# Altium project PMP20873E1.PrjPcb (part 4 of 4)
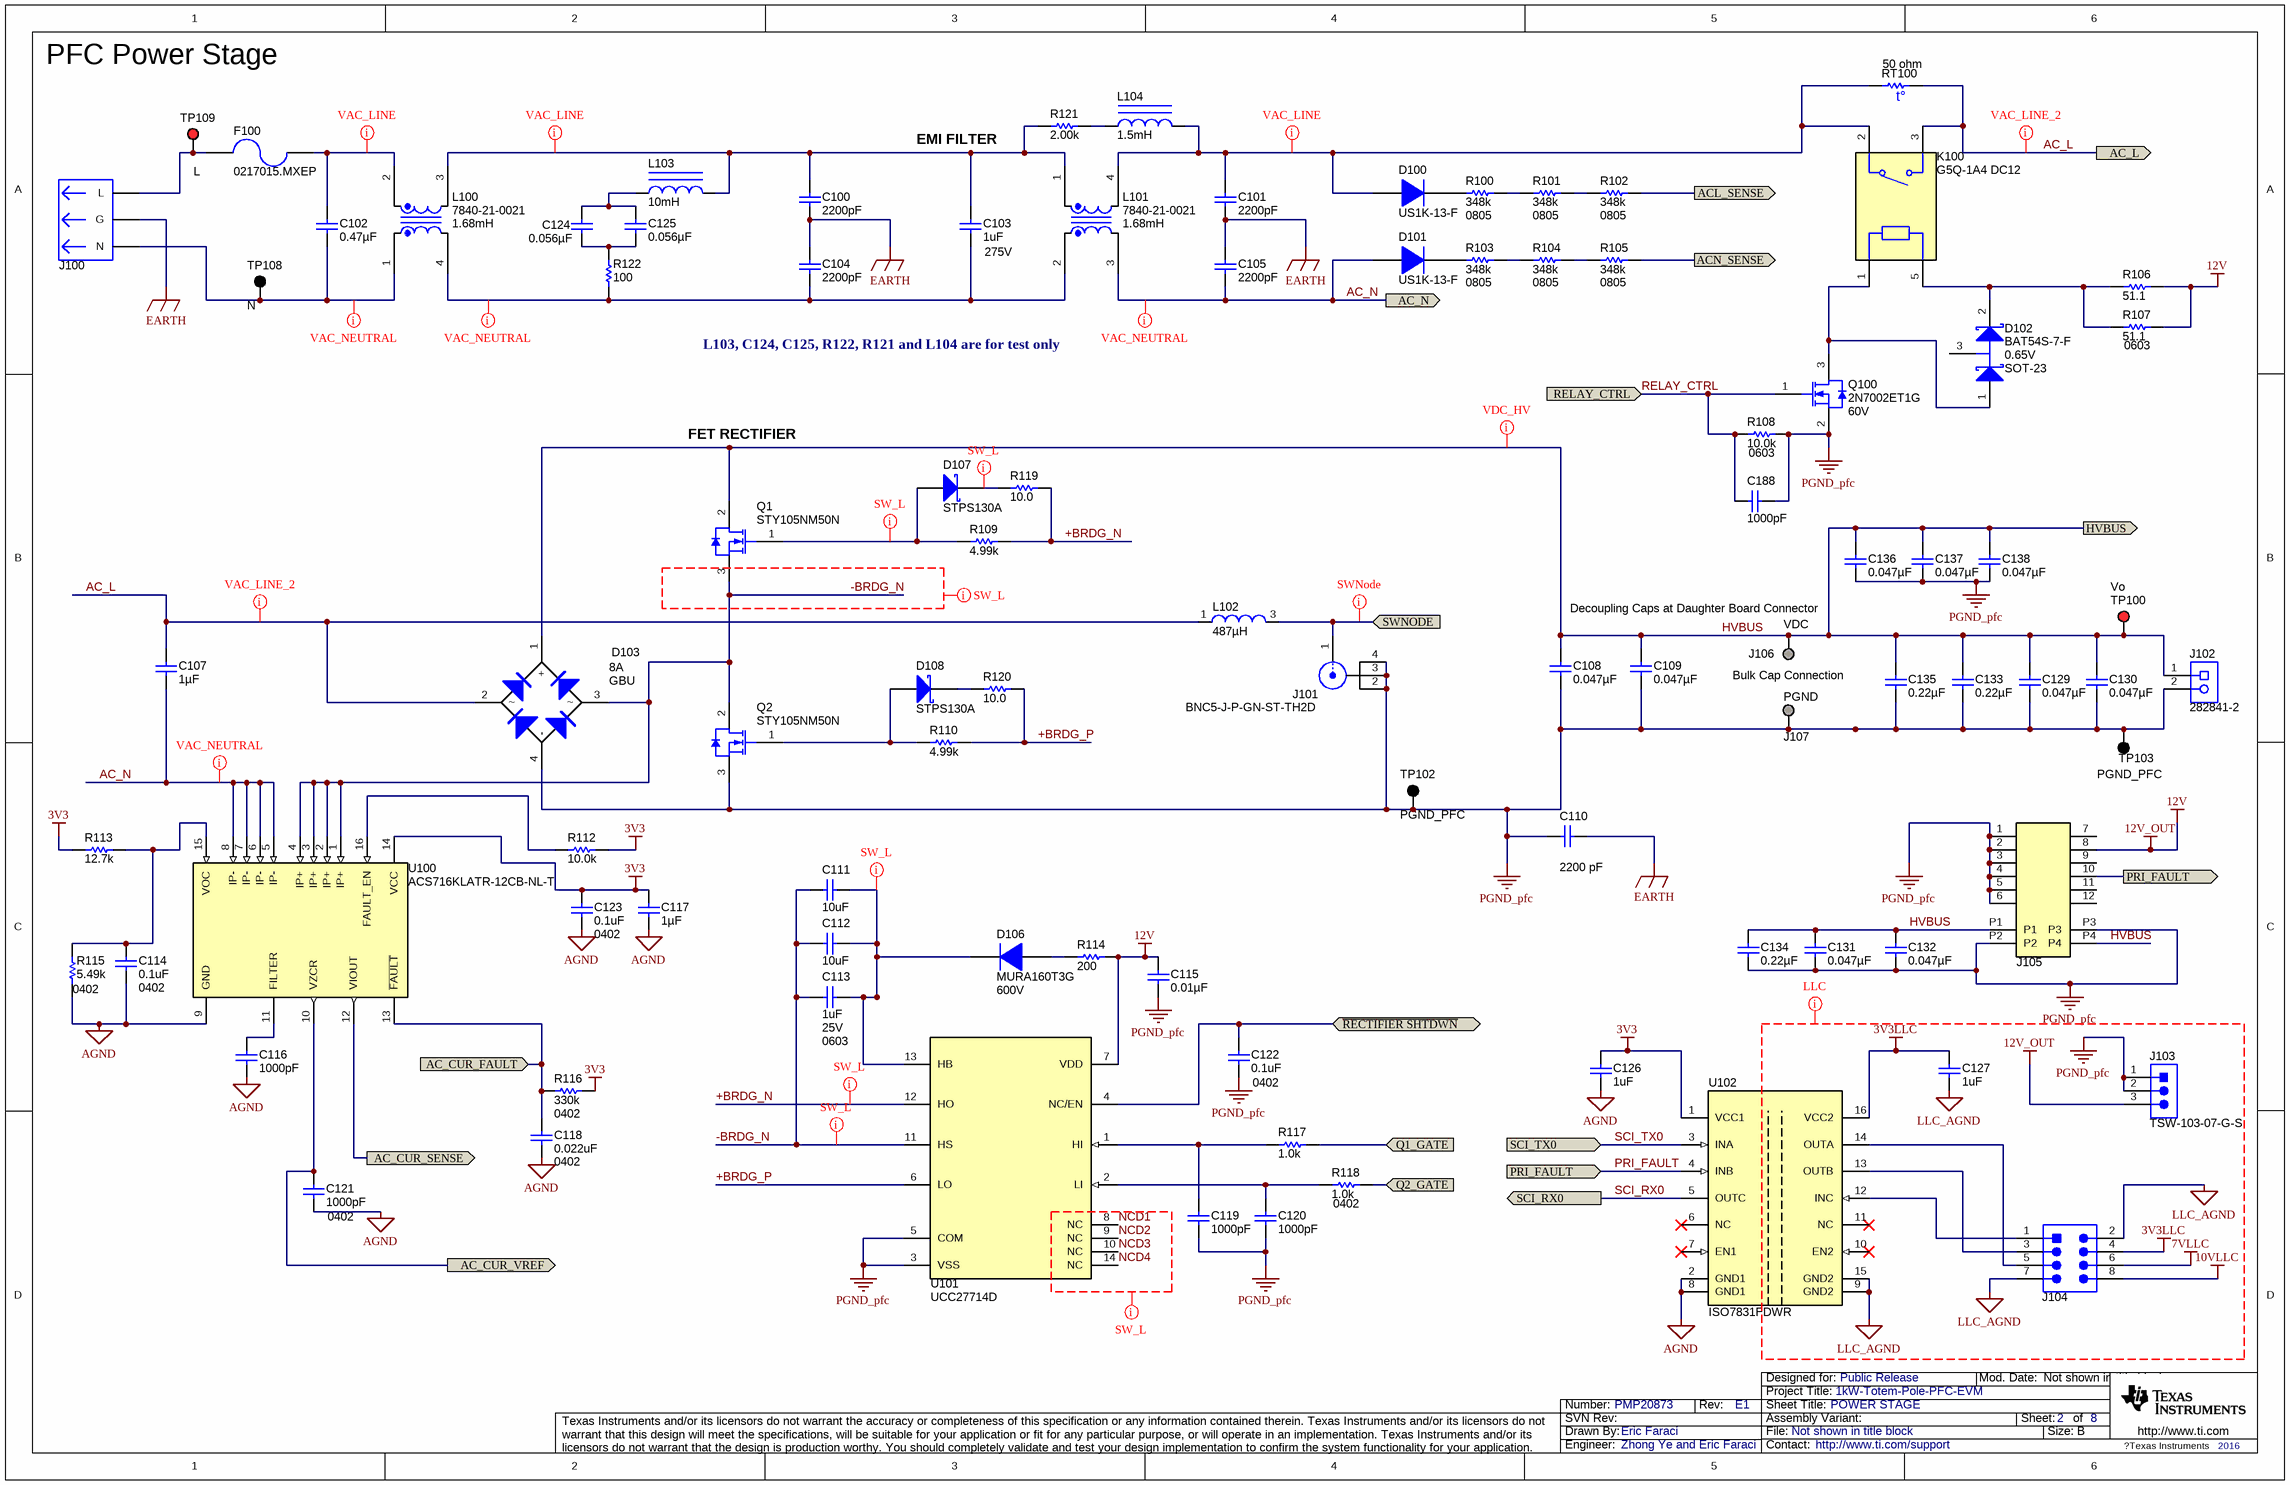
[diagram p5: PMP20873E1_Power.SchDoc]

## Sheet PMP20873E1_Power.SchDoc: POWER STAGE (continued)

### Library data of the parts
C100 C101 C104 C105 = DE2E3KY222MA2BM01: CAP, CERM, 2200pF, 250V, +/-20%, KY, Radial D8x5mm; Manufacturer: MuRata; Polarized: N; CompType: Capacitor; U/M: EA; Cap_F: 0.0000000022; Tolerance_%: 20; Value1: Unknown; VDC_V: 250; TaMin_C: -25; TaMax_C: 85; SymbolVersion: 2008-07-09; Value: 2200pF; PartNumber: DE2E3KY222MA2BM01; PackageReference: Radial D8x5mm; RoHS: Y; Value2: 250V; MountType: SMT; Technology: Ceramic; TempCo: KY; Cap_Case: CAPRD500W60D800H850; Published: 2008-06-19; Publisher: Texas Instruments; LatestRevisionDate: 2013-05-24; LatestRevisionNote: Changed publisher; ComponentLink1Description: Datasheet link; ComponentLink1URL: http://www.murata.com/products/catalog/pdf/c85e.pdf; Supplier 1: Digi-Key; Supplier Part Number 1: 490-4231-ND; Supplier 2: Mouser; Supplier Part Number 2: 81-DE2E3KY222MA2BM01; Supplier 3: Farnell; Supplier Part Number 3: 1515842
C102 = ECQ-U2A474ML: CAP, Film, 0.47 µF, 275 V, +/- 20%, TH; Manufacturer: Panasonic; Polarized: N; CompType: Capacitor; Value: 0.47uF; U/M: EA; Cap_F: 0.00000047; Tolerance_%: 20; Value1: Unknown; VDC_V: 275; Value2: 275V; TaMin_C: -40; TaMax_C: 100; Cap_Case: Radial 25x8.5x18.5; AEC Category: Q200; SymbolVersion: 2008-07-09; PartNumber: ECQ-U2A474ML; PackageReference: Radial 25x8.5x18.5; RoHS: Y; MountType: TH; Technology: Film; Series: ECQUL; Publisher: Texas Instruments; LatestRevisionDate: 2016-02-02; ComponentLink1Description: Datasheet link; ComponentLink1URL: http://industrial.panasonic.com/www-data/pdf/ABD0000/ABD0000CE29.pdf; Supplier 1: Digi-Key; Supplier Part Number 1: P10734-ND; Supplier 2: Mouser; Supplier Part Number 2: 667-ECQ-U2A474ML; Supplier 3: Farnell; Supplier Part Number 3: 1198299; AEC Qualified: ?
C103 = ECQ-U2A474ML: CAP, Film, 1uF, 275V, +/-20%, TH; Manufacturer: Panasonic; Alternate PartNumber: R46KN410000P1M; Alternate Manufacturer: Kemet; Polarized: N; CompType: Capacitor; U/M: EA; Cap_F: 0.00000047; Tolerance_%: 20; Value1: Unknown; VDC_V: 275; TaMin_C: -40; TaMax_C: 100; Cap_Case: Radial 26x12x19.5; SymbolVersion: 2008-07-09; Value: 1uF; PartNumber: R46KN-4100--P1 M; PackageReference: Radial 26x12x19.5; RoHS: Y; MountType: TH; Technology: Film; Series: ECQUA; Publisher: Texas Instruments; LatestRevisionDate: 2013-05-06; ComponentLink1Description: Datasheet link; ComponentLink1URL: http://industrial.panasonic.com/www-data/pdf/ABD0000/ABD0000CE53.pdf; Supplier 1: Digi-Key; Supplier Part Number 1: P10734-ND; Supplier 2: Mouser; Supplier Part Number 2: 667-ECQ-U2A474ML; Supplier 3: Farnell; Supplier Part Number 3: 1198299
C107 = 450MPK105J: CAP, Film, 1 µF, 450 V, +/- 5%, TH; Manufacturer: Rubycon; Polarized: N; CompType: Capacitor; Value: 1uF; U/M: EA; Cap_F: 0.000001; Tolerance_%: 5; Value1: Unknown; VDC_V: 450; Value2: 450V; TaMin_C: -40; TaMax_C: 105; Cap_Case: 18x9.5mm; AEC Category: Q200; SymbolVersion: 2008-07-09; PartNumber: 450MPK105J; PackageReference: 18x9.5mm; RoHS: Y; MountType: TH; Technology: Film; Series: MPK; Publisher: Texas Instruments; LatestRevisionDate: 2016-02-02; ComponentLink1Description: Datasheet link; ComponentLink1URL: http://www.rubycon.co.jp/en/catalog/e_pdfs/film/e_mpk.pdf; Supplier 1: Digi-Key; Supplier Part Number 1: 1189-1822-ND; AEC Qualified: N; AEC Grade: N/A
C108 C109 C129-C132 C136-C138 = GRM32DR72J473KW01L: CAP, CERM, 0.047 µF, 630 V, +/- 10%, X7R, 1210; Manufacturer: MuRata; Polarized: N; CompType: Capacitor; Value: 0.047uF; U/M: EA; Cap_F: 0.000000047; Tolerance_%: 10; Value1: Unknown; VDC_V: 630; Value2: 630V; TaMin_C: -55; TaMax_C: 125; AEC Category: Q200; SymbolVersion: 2008-07-09; PartNumber: GRM32DR72J473KW01L; PackageReference: 1210; RoHS: Y; MountType: SMT; Technology: Ceramic; TempCo: X7R; Cap_Case: 1210; Published: 2008-06-19; Publisher: Texas Instruments; LatestRevisionDate: 2015-12-09; ComponentLink1Description: Datasheet link; ComponentLink1URL: http://search.murata.co.jp/Ceramy/PnsearchViewAction.do?HnOFG=ON&HnNFG=ON&SEL_CNT=50&sLang=en&sKey=GRM32DR72J473KW01L&x=9&y=9&search=startwith; Supplier 1: Digi-Key; Supplier Part Number 1: 490-3516-1-ND; Supplier 2: Mouser; Supplier Part Number 2: 81-GRM32DR72J473KW01; Supplier 3: Farnell; Supplier Part Number 3: 1828962; AEC Qualified: ?
C110 = DE1E3KX222MA4BL01: CAP, CERM, 2200pF, 250V, +/-20%, E, Cap, 7x12x9 mm TH; Manufacturer: Kemet; Tolerance_%: 20 %; Capacitance - nF: 2.2 nF; Capacitance - uF: 0.0022 uF; Case Diameter: 9 mm; TempCo: Y5U; Product Status: New Product; Supplier 1: Mouser; Supplier Part Number 1: 80-C921U222MYWDBAP; PartNumber: C921U222MYWDBA7317; RoHS: RoHS Compliant; Pricing 1: 1=0.330, 10=0.192, 100=0.129, 500=0.096, 1000=0.081, 2500=0.071, 10000=0.065, 25000=0.064, 50000=0.062 (USD); Packaging: Ammo; Product: AC Line Rated Class X1/Y2 Capacitors; Series: C900; MountType: Radial; VDC_V: 250 V; Lead Spacing: 10 mm; RoHS - Mouser: Y; Minimum Order Quantity: 1; Reeling: False; ComponentLink1URL: http://www.mouser.com/ds/2/212/KEM_C1064_X1_400 VAC_Y2_250 VAC-253332.pdf; ComponentLink1Description: http://www.mouser.com/ds/2/212/KEM_C1064_X1_400 VAC_Y2_250 VAC-253332.pdf
C111 C112 = 0805YD106MAT2A: CAP, CERM, 10uF, 16V, +/-20%, X5R, 0805; Manufacturer: AVX; Polarized: N; CompType: Capacitor; U/M: EA; Cap_F: 0.00001; Tolerance_%: 20; Value1: Unknown; VDC_V: 16; TaMin_C: -55; TaMax_C: 85; Cap_Case: 0805; SymbolVersion: 2008-07-09; Value: 10uF; PartNumber: 0805YD106MAT2A; PackageReference: 0805; RoHS: Y; Value2: 16V; MountType: SMT; Technology: Ceramic; TempCo: X5R; Published: 2008-06-19; Publisher: Texas Instruments; LatestRevisionDate: 2013-05-24; LatestRevisionNote: Changed publisher; ComponentLink1Description: Datasheet link; ComponentLink1URL: http://www.avx.com/docs/Catalogs/cx5r.pdf; Supplier 1: Farnell; Supplier Part Number 1: 1582704
C113 C126 C127 = C1608X7R1E105K080AB: CAP, CERM, 1uF, 25V, +/-10%, X7R, 0603; Manufacturer: TDK; Polarized: N; CompType: Capacitor; U/M: EA; Cap_F: 0.000001; Tolerance_%: 10; Value1: Unknown; VDC_V: 25; TaMin_C: -55; TaMax_C: 125; SymbolVersion: 2008-07-09; Value: 1uF; PartNumber: C1608X7R1E105K080AB; PackageReference: 0603; RoHS: Y; MountType: SMT; Technology: Ceramic; TempCo: X7R; Cap_Case: 0603; Published: 2008-06-19; Publisher: Texas Instruments; LatestRevisionDate: 2013-05-24; LatestRevisionNote: Changed publisher; ComponentLink1Description: Datasheet link; ComponentLink1URL: http://www.tdk.com/pdf/TDKMLCCCapRange.pdf; Supplier 1: Digi-Key; Supplier Part Number 1: 445-5956-1-ND
  C126 C127: Value2: 25V
C114 C122 C123 = GRM155R70J104KA01D: CAP, CERM, 0.1uF, 6.3V, +/-10%, X7R, 0402; Manufacturer: MuRata; Polarized: N; CompType: Capacitor; U/M: EA; Cap_F: 0.0000001; Tolerance_%: 10; Value1: Unknown; VDC_V: 6.3; TaMin_C: -55; TaMax_C: 125; SymbolVersion: 2008-07-09; Value: 0.1uF; PartNumber: GRM155R70J104KA01D; PackageReference: 0402; RoHS: Y; Value2: 6.3V; MountType: SMT; Technology: Ceramic; TempCo: X7R; Cap_Case: 0402; Published: 2008-06-19; Publisher: Texas Instruments; LatestRevisionDate: 2013-05-24; LatestRevisionNote: Changed publisher; ComponentLink1Description: Datasheet link; ComponentLink1URL: http://search.murata.co.jp/Ceramy/PnsearchViewAction.do?HnOFG=ON&HnNFG=ON&SEL_CNT=50&sLang=en&sKey=GRM155R70J104KA01D&x=9&y=9&search=startwith; Supplier 1: Digi-Key; Supplier Part Number 1: GRM155R70J104KA01D-ND; Supplier 2: Mouser; Supplier Part Number 2: 81-GRM155R70J104KA1D
C115 = C0603X103K5RACTU: CAP, CERM, 0.01uF, 50V, +/-10%, X7R, 0603; Manufacturer: Kemet; Polarized: N; CompType: Capacitor; U/M: EA; Cap_F: 0.00000001; Tolerance_%: 10; Value1: Unknown; VDC_V: 50; TaMin_C: -55; TaMax_C: 125; SymbolVersion: 2008-07-09; Value: 0.01uF; PartNumber: C0603X103K5RACTU; PackageReference: 0603; RoHS: Y; Value2: 50V; MountType: SMT; Technology: Ceramic; TempCo: X7R; Cap_Case: 0603; Published: 2008-06-19; Publisher: Texas Instruments; LatestRevisionDate: 2014-05-23; ComponentLink1Description: Datasheet link; ComponentLink1URL: http://www.kemet.com/kemet/web/homepage/kechome.nsf/vapubfiles/F3102_Y5V.pdf/$file/F3102_Y5V.pdf; Supplier 1: Digi-Key; Supplier Part Number 1: 399-5346-1-ND; Supplier 2: Mouser; Supplier Part Number 2: 80-C0603X103K5R; Supplier 3: Farnell; Supplier Part Number 3: 1414026
C116 = C1608X7R1H102K: CAP, CERM, 1000pF, 50V, +/-10%, X7R, 0603; Manufacturer: TDK; Polarized: N; CompType: Capacitor; U/M: EA; Cap_F: 0.000000001; Tolerance_%: 10; ESR_Ohm: 0.24; Value1: 0.24 ohm; VDC_V: 50; TaMin_C: -55; TaMax_C: 125; SymbolVersion: 2008-07-09; Value: 1000pF; PartNumber: C1608X7R1H102K; PackageReference: 0603; RoHS: Y; Value2: 50V; MountType: SMT; Technology: Ceramic; TempCo: X7R; Cap_Case: 0603; Published: 2008-06-19; Publisher: Texas Instruments; LatestRevisionDate: 2014-01-24; ComponentLink1Description: Datasheet link; ComponentLink1URL: http://www.tdk.co.jp/tefe02/e412_c.pdf; Supplier 1: Digi-Key; Supplier Part Number 1: 445-1308-1-ND; Supplier 2: Farnell; Supplier Part Number 2: 1844239
C117 = GRM185R60J105KE26D: CAP, CERM, 1uF, 6.3V, +/-10%, X5R, 0603; Manufacturer: MuRata; Polarized: N; CompType: Capacitor; U/M: EA; Cap_F: 0.000001; Tolerance_%: 10; Value1: Unknown; VDC_V: 6.3; TaMin_C: -55; TaMax_C: 85; SymbolVersion: 2008-07-09; Value: 1uF; PartNumber: GRM185R60J105KE26D; PackageReference: 0603; RoHS: Y; Value2: 6.3V; MountType: SMT; Technology: Ceramic; TempCo: X5R; Cap_Case: 0603; Published: 2008-06-19; Publisher: Texas Instruments; LatestRevisionDate: 2014-01-24; ComponentLink1Description: Datasheet link; ComponentLink1URL: http://search.murata.co.jp/Ceramy/PnsearchViewAction.do?HnOFG=ON&HnNFG=ON&SEL_CNT=50&sLang=en&sKey=GRM185R60J105KE26D&x=9&y=9&search=startwith; Supplier 1: Mouser; Supplier Part Number 1: 81-GRM185R60J105KE26
C118 = GRM155R70J223KA01D: CAP, CERM, 0.022uF, 6.3V, +/-10%, X7R, 0402; Manufacturer: MuRata; Polarized: N; CompType: Capacitor; U/M: EA; Cap_F: 0.000000022; Tolerance_%: 10; Value1: Unknown; VDC_V: 6.3; TaMin_C: -55; TaMax_C: 125; SymbolVersion: 2008-07-09; Value: 0.022uF; PartNumber: GRM155R70J223KA01D; PackageReference: 0402; RoHS: Y; Value2: 6.3V; MountType: SMT; Technology: Ceramic; TempCo: X7R; Cap_Case: 0402; Published: 2008-06-19; Publisher: Texas Instruments; LatestRevisionDate: 2013-05-24; LatestRevisionNote: Changed publisher; ComponentLink1Description: Datasheet link; ComponentLink1URL: http://search.murata.co.jp/Ceramy/PnsearchViewAction.do?HnOFG=ON&HnNFG=ON&SEL_CNT=50&sLang=en&sKey=GRM155R70J223KA01D&x=9&y=9&search=startwith; Supplier 1: Digi-Key; Supplier Part Number 1: GRM155R70J223KA01D-ND; Supplier 2: Mouser; Supplier Part Number 2: 81-GRM155R70J223KA1D
C119 = C1005X7R1H102K: CAP, CERM, 1000pF, 50V, +/-10%, X7R, 0402; Manufacturer: TDK; Polarized: N; CompType: Capacitor; U/M: EA; Cap_F: 0.000000001; Tolerance_%: 10; ESR_Ohm: 0.2381; Value1: 0.2381 ohm; VDC_V: 50; TaMin_C: -55; TaMax_C: 125; SymbolVersion: 2008-07-09; Value: 1000pF; PartNumber: C1005X7R1H102K; PackageReference: 0402; RoHS: Y; Value2: 50V; MountType: SMT; Technology: Ceramic; TempCo: X7R; Cap_Case: 0402; Published: 2008-06-19; Publisher: Texas Instruments; LatestRevisionDate: 2014-05-23; ComponentLink1Description: Datasheet link; ComponentLink1URL: http://www.tdk.co.jp/tefe02/e412_c.pdf; Supplier 1: Digi-Key; Supplier Part Number 1: 445-1256-1-ND; Supplier 2: Farnell; Supplier Part Number 2: 1907278
C120 C121 = GRM155R60J102KA01D: CAP, CERM, 1000pF, 6.3V, +/-10%, X5R, 0402; Manufacturer: MuRata; Polarized: N; CompType: Capacitor; U/M: EA; Cap_F: 0.000000001; Tolerance_%: 10; Value1: Unknown; VDC_V: 6.3; TaMin_C: -55; TaMax_C: 85; SymbolVersion: 2008-07-09; Value: 1000pF; PartNumber: GRM155R60J102KA01D; PackageReference: 0402; RoHS: Y; Value2: 6.3V; MountType: SMT; Technology: Ceramic; TempCo: X5R; Cap_Case: 0402; Published: 2008-06-19; Publisher: Texas Instruments; LatestRevisionDate: 2013-05-24; LatestRevisionNote: Changed publisher; ComponentLink1Description: Datasheet link; ComponentLink1URL: http://search.murata.co.jp/Ceramy/PnsearchViewAction.do?HnOFG=ON&HnNFG=ON&SEL_CNT=50&sLang=en&sKey=GRM155R60J102KA01D&x=9&y=9&search=startwith; Supplier 1: Digi-Key; Supplier Part Number 1: GRM155R60J102KA01D-ND; Supplier 2: Mouser; Supplier Part Number 2: 81-GRM155R60J102KA1D
C124 C125 = GA355XR7GB563KW06L: CAP, CERM, 0.056 µF, 250 V, +/- 10%, X7R, 2220; Manufacturer: MuRata; Polarized: N; CompType: Capacitor; Value: 0.056uF; U/M: EA; Cap_F: 0.000000056; Tolerance_%: 10; Value1: Unknown; VDC_V: 250; Value2: 250V; TaMin_C: -55; TaMax_C: 125; Cap_Case: 2220; AEC Category: Q200; SymbolVersion: 2008-07-09; PartNumber: GA355XR7GB563KW06L; PackageReference: 2220; RoHS: Y; MountType: SMT; Technology: Ceramic; TempCo: X7R; Published: 2008-06-19; Publisher: Texas Instruments; LatestRevisionDate: 2015-12-08; ComponentLink1Description: Datasheet link; ComponentLink1URL: http://psearch.murata.com/capacitor/product/GA355XR7GB563KW06%23.pdf; Supplier 1: Digi-Key; Supplier Part Number 1: 490-7747-1-ND; Supplier 2: Mouser; Supplier Part Number 2: 81-GA355XR7GB563KW6L; Supplier 3: Farnell; Supplier Part Number 3: 2218676; AEC Qualified: N; AEC Grade: N/A
C133-C135 = GRM55DR72J224KW01L: CAP, CERM, 0.22 µF, 630 V, +/- 10%, X7R, 2220; Manufacturer: MuRata; Polarized: N; CompType: Capacitor; Value: 0.22uF; U/M: EA; Cap_F: 0.00000022; Tolerance_%: 10; Value1: Unknown; VDC_V: 630; Value2: 630V; TaMin_C: -55; TaMax_C: 125; AEC Category: Q200; SymbolVersion: 2008-07-09; PartNumber: GRM55DR72J224KW01L; PackageReference: 2220; RoHS: Y; MountType: SMT; Technology: Ceramic; TempCo: X7R; Cap_Case: 2220; Published: 2008-06-19; Publisher: Texas Instruments; LatestRevisionDate: 2015-12-09; ComponentLink1Description: Datasheet link; ComponentLink1URL: http://search.murata.co.jp/Ceramy/PnsearchViewAction.do?HnOFG=ON&HnNFG=ON&SEL_CNT=50&sLang=en&sKey=GRM55DR72J224KW01L&x=9&y=9&search=startwith; Supplier 1: Digi-Key; Supplier Part Number 1: 490-3520-1-ND; Supplier 2: Mouser; Supplier Part Number 2: 81-GRM55DR72J224KW01; Supplier 3: Farnell; Supplier Part Number 3: 1828967; AEC Qualified: ?
C188 = GRM188R71C102KA01D: CAP, CERM, 1000pF, 16V, +/-10%, X7R, 0603; Manufacturer: MuRata; Polarized: N; CompType: Capacitor; U/M: EA; Cap_F: 0.000000001; Tolerance_%: 10; Value1: Unknown; VDC_V: 16; TaMin_C: -55; TaMax_C: 125; SymbolVersion: 2008-07-09; Value: 1000pF; PartNumber: GRM188R71C102KA01D; PackageReference: 0603; RoHS: Y; Value2: 16V; MountType: SMT; Technology: Ceramic; TempCo: X7R; Cap_Case: 0603; Published: 2008-06-19; Publisher: Texas Instruments; LatestRevisionDate: 2014-07-08; ComponentLink1Description: Datasheet link; ComponentLink1URL: http://search.murata.co.jp/Ceramy/PnsearchViewAction.do?HnOFG=ON&HnNFG=ON&SEL_CNT=50&sLang=en&sKey=GRM188R71C102KA01D&x=9&y=9&search=startwith; Supplier 1: Digi-Key; Supplier Part Number 1: GRM188R71C102KA01D-ND; Supplier 2: Mouser; Supplier Part Number 2: 81-GRM188R71C102KA1D
D100 D101 = US1K-13-F: Diode, Fast Rectifier, 800 V, 1 A, SMA; Manufacturer: Diodes Inc.; U/M: EA; Vf_V: 1.7; Value: 800V; Value1: 1A; Value2: 1.7V; Io_A: 1; Vr_V: 800; TJmax_C: 150; AEC Category: Q101; SymbolVersion: 2008-12-08; PartNumber: US1K-13-F; PackageReference: SMA; CompType: Diode; MountType: SMT; Type: Fast Rectifier; RoHS: Y; Published: 2008-06-26; Publisher: Texas Instruments; LatestRevisionDate: 2015-10-30; ComponentLink1Description: Datasheet link; ComponentLink1URL: http://diodes.com/datasheets/ds16008.pdf; Supplier 1: Digi-Key; Supplier Part Number 1: US1K-FDICT-ND; Supplier 2: Mouser; Supplier Part Number 2: 621-US1K-F; Supplier 3: Newark; Supplier Part Number 3: 12T2263; AEC Qualified: ?
D102 = BAT54S-7-F: Diode, Schottky, 30V, 0.2A, SOT-23; Manufacturer: Diodes Inc.; U/M: EA; Vf_V: 0.65; Io_A: 0.2; Vr_V: 30; TJmax_C: 125; SymbolVersion: 2008-12-08; CompType: Diode; PartNumber: BAT54S-7-F; MountType: SMT; RoHS: Y; PackageReference: SOT-23; Value1: 0.2A; Value2: 30V; Type: Schottky; Published: 2008-06-26; Publisher: Texas Instruments; LatestRevisionDate: 2013-05-24; ComponentLink1Description: Datasheet link; ComponentLink1URL: http://www.diodes.com/datasheets/ds11005.pdf; Supplier 1: Digi-Key; Supplier Part Number 1: BAT54S-FDICT-ND; Supplier 2: Mouser; Supplier Part Number 2: 621-BAT54S-F; Supplier 3: Farnell; Supplier Part Number 3: 1843723
D103 = GBU8J-BP: Diode, Switching-Bridge, 420V, 8A, TH; Manufacturer: Micro Commercial Components; Value: 1V; U/M: EA; Vf_V: 1; Io_A: 8; Vr_V: 420; TJmax_C: 175; CompType: Diode; SymbolVersion: 2009-10-05; PartNumber: GBU8J-BP; PackageReference: GBU; Value2: 420V; MountType: TH; Type: Switching-Bridge; RoHS: Y; Published: 2008-06-26; Publisher: Texas Instruments; LatestRevisionDate: 2013-05-24; ComponentLink1Description: Datasheet link; ComponentLink1URL: http://www.mccsemi.com/up_pdf/GBU8A-GBU8M%28GBU%29.pdf; Supplier 1: Digi-Key; Supplier Part Number 1: GBU8J-BPMS-ND; Supplier 2: Mouser; Supplier Part Number 2: 833-GBU8J-BP
D106 = MURA160T3G: Diode, Ultrafast, 600V, 1A, SMA; Manufacturer: ON Semiconductor; U/M: EA; Vf_V: 1.05; Value2: 1.05V; Io_A: 1; Vr_V: 600; TJmax_C: 175; SymbolVersion: 2008-12-08; PartNumber: MURA160T3G; PackageReference: SMA; CompType: Diode; Value1: 1A; MountType: SMT; Type: Ultrafast; RoHS: Y; Published: 2008-06-26; Publisher: Texas Instruments; LatestRevisionDate: 2014-01-24; ComponentLink1Description: Datasheet link; ComponentLink1URL: http://www.onsemi.com/pub_link/Collateral/MURA160T3-D.PDF; Supplier 1: Digi-Key; Supplier Part Number 1: MURA160T3GOSCT-ND; Supplier 2: Mouser; Supplier Part Number 2: 863-MURA160T3G; Supplier 3: Farnell; Supplier Part Number 3: 1459149
D107 D108 = STPS130A: Diode, Schottky, 30 V, 1 A, SMA; Manufacturer: STMicroelectronics; U/M: EA; Vf_V: 0.46; Value: 30V; Value1: 1A; Value2: 0.46V; Io_A: 1; Vr_V: 30; TJmax_C: 150; AEC Category: Q101; CompType: Diode; SymbolVersion: 2008-12-08; PartNumber: STPS130A; PackageReference: SMA; MountType: SMT; Type: Schottky; RoHS: Y; Published: 2008-06-26; Publisher: Texas Instruments; LatestRevisionDate: 2015-10-13; ComponentLink1Description: Datasheet link; ComponentLink1URL: http://www.st.com/web/en/resource/technical/document/datasheet/CD00000992.pdf; Supplier 1: Digi-Key; Supplier Part Number 1: 497-3755-2-ND; Supplier 2: Mouser; Supplier Part Number 2: 511-STPS130A; Supplier 3: Newark; Supplier Part Number 3: 89K1580; AEC Qualified: ?
F100 = 0217015.MXEP: Fuse, 15 A, 250 V, TH; Manufacturer: Littelfuse; U/M: EA; VDC_V: 250; Irating_A: 15; Rtyp_Ohm: 0.04; MeltingTyp: 617.135; Vdrop: 0.13; SymbolVersion: 2008-07-09; PartNumber: 0217015.MXEP; PackageReference: D5.5xL21.5mm; CompType: Fuse; Published: 2009-03-05; RoHS: Y; Publisher: Texas Instruments; LatestRevisionDate: 2015-10-29; ComponentLink1Description: Datasheet link; ComponentLink1URL: http://www.littelfuse.com/~/media/electronics/datasheets/fuses/littelfuse_fuse_217_datasheet.pdf.pdf; MountType: TH; Supplier 1: Digi-Key; Supplier Part Number 1: F4638-ND; Supplier 2: Mouser; Supplier Part Number 2: 576-0217015.MXEP
J100 = 703W-00/54: AC Receptacle, 10A 250VAC; Manufacturer: Qualtek Electronics Corporation; SymbolCreator: a0799628; CompType: Connector; U/M: EA; SymbolVersion: 2013-20-02; PartNumber: 703W-00/54; PackageReference: 20X50X28.7mm; RoHS: Y; MountType: TH; ComponentLink1Description: Datasheet Link; ComponentLink1URL: http://www.qualtekusa.com/Catalog/AC_Receptacles/pdfs/703w0054.pdf; Publisher: Texas Instruments; LatestRevisionDate: 2015-10-12; Supplier 1: Digi-Key; Supplier Part Number 1: Q220-ND; Supplier 2: Mouser; Supplier Part Number 2: 562-703W-00/54
J101 = BNC5-J-P-GN-ST-TH2D: 50 OHM BNC ELEVATED STRAIGHT JACK, TH; Manufacturer: Samtec; SymbolCreator: Altium; Gender: Male; ContactFinish: Gold; SymbolVersion: 2014-10-27; PartNumber: BNC5-J-P-GN-ST-TH2D; PackageReference: 50 OHM BNC ELEVATED STRAIGHT JACK, TH; CompType: JACK; RoHS: Y; MountType: TH; ComponentLink1Description: Datasheet URL; ComponentLink1URL: http://suddendocs.samtec.com/prints/bnc5-j-p-xx-st-th2d-mkt.pdf; Orientation: Vertical; PinCount: 4; Publisher: Texas Instruments; LatestRevisionDate: 2015-12-14
J102 = 282841-2: Terminal Block, 2x1, 5.08mm, TH; Manufacturer: TE Connectivity; SymbolCreator: a0412235; U/M: EA; SymbolVersion: 2013-09-04; PartNumber: 282841-2; PackageReference: 10.16x15.2x9mm; CompType: Terminal Block; RoHS: Y; MountType: TH; ComponentLink1Description: Datasheet Link; ComponentLink1URL: http://www.te.com/commerce/DocumentDelivery/DDEController?Action=srchrtrv&DocNm=282841&DocType=Customer+Drawing&DocLang=English; Publisher: Texas Instruments; LatestRevisionDate: 2014-06-24; Supplier 1: Digi-Key; Supplier Part Number 1: A98342-ND; Supplier 2: Mouser; Supplier Part Number 2: 571-2828412; Supplier 3: Farnell; Supplier Part Number 3: 1767503
J103 = TSW-103-07-G-S: Header, 100mil, 3x1, Gold, TH; Manufacturer: Samtec; SymbolCreator: a0799628; Pitch_mm: 2.54; Gender: Male; Shrouded: N; Row_Count: 1; Current_A: 6.3; Voltage_V: 550; Cert_CSA: Y; SymbolVersion: 2013-03-28; PartNumber: TSW-103-07-G-S; PackageReference: 3x1 Header; ClassName: Header; CompType: Header; RoHS: Y; MountType: TH; ComponentLink1Description: Datasheet URL; ComponentLink1URL: http://samtec.com/ftppub/pdf/TSW_TH.PDF; Orientation: Vertical; PinCount: 3; ContactFinish: Gold; Color: Black; Cert_UL: Y; Cert_CULUS: N; Cert_VDE: N; Publisher: Texas Instruments; LatestRevisionDate: 2015-12-14; Supplier 1: Digi-Key; Supplier Part Number 1: SAM1029-03-ND
J104 = TSW-104-07-G-D: Header, 100mil, 4x2, Gold, TH; Manufacturer: Samtec; SymbolCreator: a0411947; Pitch_mm: 2.54; Gender: Male; Shrouded: N; Row_Count: 2; Current_A: 6.3; Voltage_V: 550; Cert_CSA: Y; SymbolVersion: 2013-12-22; PartNumber: TSW-104-07-G-D; PackageReference: 4x2 Header; ClassName: Header; CompType: Header; RoHS: Y; MountType: TH; ComponentLink1Description: Datasheet URL; ComponentLink1URL: http://samtec.com/ftppub/pdf/TSW_TH.PDF; Orientation: Vertical; PinCount: 8; RowSpacing_mm: 2.54; ContactFinish: Gold; Color: Black; Cert_UL: Y; Cert_CULUS: N; Cert_VDE: N; Publisher: Texas Instruments; LatestRevisionDate: 2015-12-14; Supplier 1: Digi-Key; Supplier Part Number 1: SAM1028-04-ND
J105 = PESC-02-12-02-01-L-RA-LC: Signal Power Combo Socket Strip, 4x3, 4 Power Group, R/A, Gold, TH; Manufacturer: Samtec; SymbolCreator: Altium; CompType: Power Connector; Pitch_mm: 2.54; Gender: Female; Row_Count: 3; Current_A: 40; Voltage_V: 650; Cert_UL: Y; SymbolVersion: 2015-12-4; PartNumber: PESC-02-12-02-01-L-RA-LC; PackageReference: Connector, 4x3, 4 Power Group, R/A, TH; RoHS: Y; MountType: TH; ComponentLink1Description: Datasheet URL; ComponentLink1URL: http://suddendocs.samtec.com/prints/pesc-xx-xx-xx-01-x-ra-xx-mkt.pdf; Orientation: R/A; PinCount: 12; RowSpacing_mm: 2.54; ContactFinish: Gold; Color: Black; Publisher: Texas Instruments; LatestRevisionDate: 2015-12-08
J106 J107 = 0312-0-15-15-34-27-10-0: Pin Receptacle, .032-.046" .075" Dia, Gold, TH; Manufacturer: Mill-Max; U/M: EA; SymbolVersion: 2010-10-20; PartNumber: 0312-0-15-15-34-27-10-0; PackageReference: Pin Receptacle; CompType: Pin Receptacle; RoHS: Y; MountType: TH; ComponentLink1Description: Datasheet Link; ComponentLink1URL: https://www.mill-max.com/products/datasheet/recpin/0312-0-15-15-34-27-10-0; Publisher: Texas Instruments; LatestRevisionDate: 2015-07-20; Supplier 1: Digi-Key; Supplier Part Number 1: 0312-015153427100-ND; Supplier 2: Mouser; Supplier Part Number 2: 575-0312015153427
K100 = G5Q-1A4 DC12: Relay, SPST-NO (1 Form A), 10 A, 12 VDC, TH; Manufacturer: Omron Electronic Components; SymbolCreator: Altium; Coil Current: 16.7 mA; Coil Power: 200 mW; Coil Resistance: 720 ohms; Coil Type: Non Latching; Coil Voltage: 12 VDC; Contact Rating: 10 A; Turn Off Voltage (Min): 0.6 VDC; Turn On Voltage (Max): 9 VDC; Time Operate (s): 0.01; Time Release (s): 0.005; SymbolVersion: 2016-03-29; PartNumber: G5Q-1A4 DC12; MountType: TH; PackageReference: 20x10mm; ComponentLink1Description: Datasheet Link; ComponentLink1URL: http://www.omron.com/ecb/products/pdf/en-g5q.pdf; RoHS: Y; Contact Form: SPST-NO (1 Form A); Supplier 1: Digi-Key; Supplier Part Number 1: Z223-ND; Supplier 2: Mouser; Supplier Part Number 2: 653-G5Q-1A4-DC12
L100 L101 = 7840-21-0021: Coupled inductor, 1.68 mH,  A,  ohm, TH; Manufacturer: Nova Magnetics; SymbolCreator: a0799628; Value: 1.68mH; Ind_H: 1.7E-3; SymbolVersion: 2013-03-27; PartNumber: 7840-21-0021; PackageReference: D1064xT570mil; MountType: TH; ComponentLink1URL: https://sps06.itg.ti.com/sites/KMS/crossdivteams/altium/docs/ComponentDatasheets/7840-21-0021.pdf; ComponentLink1Description: Datasheet URL; CompType: Coupled Inductor; Publisher: Texas Instruments; Published: 2008-05-16; LatestRevisionDate: 2015-12-16
L102 = 7840-09-0014: Inductor, Toroid, Ferrite, 481 µH, 0.057 ohm, TH; Manufacturer: GCI technologies; SymbolCreator: a0411947; Value: 487uH; DCR_ohm: 0.057; Value2: A; AEC Category: Q200; SymbolVersion: 2013-06-11; PartNumber: G164005LF; CompType: Inductor; Value1: 0.057 ohm; Technology: Toroid; MountType: TH; Material: Ferrite; Published: 2008-06-26; Publisher: Texas Instruments; LatestRevisionDate: 2015-10-26; ComponentLink1Description: Datasheet link; RoHS: Y; AEC Qualified: ?
L103 = ASPI-0403S-103M-T: Inductor, Wirewound, 10 mH, 0.02 A, 32.8 ohm, SMD; Manufacturer: Abracon Corporation; Value: 10mH; Ind_H: 10.0E-3; Imax_A: 0.02; DCR_ohm: 32.8; Value2: 0.02A; AEC Category: Q200; AEC Qualified: N; SymbolVersion: 2008-07-23; CompType: Inductor; PartNumber: ASPI-0403S-103M-T; Value1: 32.8 ohm; Technology: Wirewound; MountType: SMT; Material: ?; PackageReference: 6.6X4.45mm; Published: 2008-06-26; Publisher: Texas Instruments; LatestRevisionDate: 2015-12-14; ComponentLink1Description: Datasheet link; ComponentLink1URL: http://www.abracon.com/Magnetics/new/ASPI-0403S.pdf; RoHS: Y; Supplier 1: Digi-Key; Supplier Part Number 1: ASPI-0403S-103M-TCT-ND; Supplier 2: Mouser; Supplier Part Number 2: 815-ASPI-0403S-103M; AEC Grade: N/A
L104 = LQH43MN152K03L: Inductor, Wirewound, Ferrite, 1.5 mH, 0.04 A, 37 ohm, SMD; Manufacturer: MuRata; Value: 1.5mH; Ind_H: 1.5E-3; Imax_A: 0.04; DCR_ohm: 37; Value1: 37 ohm; Value2: 0.04A; AEC Category: Q200; AEC Qualified: N; SymbolVersion: 2008-07-23; CompType: Inductor; PartNumber: LQH43MN152K03L; Technology: Wirewound; MountType: SMT; Material: Ferrite; PackageReference: 4.5x3.2mm; Published: 2008-06-26; Publisher: Texas Instruments; LatestRevisionDate: 2015-12-14; ComponentLink1Description: Datasheet link; ComponentLink1URL: http://www.murata.com/~/media/webrenewal/support/library/catalog/products/inductor/chip/o05e.ashx?la=en-sg#page=133; RoHS: Y; Supplier 1: Digi-Key; Supplier Part Number 1: 490-6655-1-ND; Supplier 2: Mouser; Supplier Part Number 2: 81-LQH43MN152K03L; AEC Grade: N/A
Q1 Q2 = STY105NM50N: MOSFET, N-CH, 500 V, 110 A, TO-247; Manufacturer: STMicroelectronics; Alternate Manufacturer: None; U/M: EA; ChType: N; Value: 500V; VdsMax_V: 500; Value1: ? ohm; Value2: 326 nC; QgTyp_nC: 326; Vgs_V: 25; IdsMax_A: 110; AEC Category: Q101; SymbolVersion: 2008-07-28; CompType: MOSFET; PartNumber: STY105NM50N; PackageReference: TO-247; RoHS: Y; MountType: TH; Published: 2008-06-19; Publisher: Texas Instruments; LatestRevisionDate: 2016-03-28; LatestRevisionNote: Added parts.; ComponentLink1Description: Datasheet link; ComponentLink1URL: http://www.st.com/web/en/resource/technical/document/datasheet/DM00038663.pdf; Supplier 1: Digi-Key; Supplier Part Number 1: 497-13290-5-ND; Supplier 2: Mouser; Supplier Part Number 2: 511-STY105NM50N; AEC Qualified: N
Q100 = 2N7002ET1G: MOSFET, N-CH, 60V, 0.26A, SOT-23; Manufacturer: ON Semiconductor; Alternate Manufacturer: None; U/M: EA; ChType: N; VdsMax_V: 60; Value1: 3 ohm; Rdson45_Ohm: 3; Value2: 0.81 nC; QgTyp_nC: 0.81; Vgs_V: 20; IdsMax_A: 0.26; SymbolVersion: 2008-07-28; CompType: MOSFET; PartNumber: 2N7002ET1G; PackageReference: SOT-23; RoHS: Y; MountType: SMT; Published: 2008-06-19; Publisher: Texas Instruments; LatestRevisionDate: 2013-05-16; LatestRevisionNote: Added parts.; ComponentLink1Description: Datasheet link; ComponentLink1URL: http://www.onsemi.com/pub_link/Collateral/2N7002E-D.PDF; Supplier 1: Digi-Key; Supplier Part Number 1: 2N7002ET1GOSCT-ND; Supplier 2: Mouser; Supplier Part Number 2: 863-2N7002ET1G; Supplier 3: Farnell; Supplier Part Number 3: 1764533
R100-R105 = RT0805BRD07348KL: RES, 348k ohm, 0.1%, 0.125W, 0805; Manufacturer: Yageo America; CompType: Resistor; Res_ohm: 348000; Tolerance_%: 0.1; Power_W: 0.125; VDC_V: 150; TempCo: 25 ppm/C; EIA_Code: E192; U/M: EA; SymbolVersion: 2009-05-29; PartNumber: RT0805BRD07348KL; RoHS: Y; Value_Code: 348k; Value1: 0.1%; Value2: 0.125W; MountType: SMT; Technology: Thin Film; Published: 2008-06-26; Publisher: Texas Instruments; LatestRevisionDate: 2013-04-29; ComponentLink1Description: Datasheet link; ComponentLink1URL: http://www.yageo.com/pdf/PYu-RT_1-to-0.05_RoHS_L_3.pdf
R106 R107 = CRCW060351R1FKEA: RES, 51.1 ohm, 1%, 0.1W, 0603; Manufacturer: Vishay-Dale; CompType: Resistor; Value_Code: 51R1; Tolerance_%: 1; Power_W: 0.1; VDC_V: 75; TempCo: 100 ppm/C; EIA_Code: E96; U/M: EA; SymbolVersion: 2009-05-29; PartNumber: CRCW060351R1FKEA; RoHS: Y; Res_ohm: 51.1; Value1: 1%; Value2: 0.1W; MountType: SMT; Technology: Thick Film; Published: 2008-06-26; Publisher: Texas Instruments; LatestRevisionDate: 2013-01-08; ComponentLink1Description: Datasheet link; ComponentLink1URL: http://www.vishay.com/docs/20035/dcrcwe3.pdf; Supplier 1: Digi-Key; Supplier Part Number 1: 541-51.1HCT-ND; Supplier 2: Mouser; Supplier Part Number 2: 71-CRCW0603-51.1-E3; Supplier 3: Farnell; Supplier Part Number 3: 1652890
  R107: PackageReference: 0603
R108 = RC0603FR-0710KL: RES, 10.0k ohm, 1%, 0.1W, 0603; Manufacturer: Yageo America; CompType: Resistor; Res_ohm: 10000; Value_Code: 10k0; Tolerance_%: 1; Power_W: 0.1; VDC_V: 150; TempCo: 200 ppm/C; EIA_Code: E96; U/M: EA; SymbolVersion: 2009-05-29; PartNumber: RC0603FR-0710KL; PackageReference: 0603; RoHS: Y; Value1: 1%; Value2: 0.1W; MountType: SMT; Technology: Thick Film; Published: 2008-06-26; Publisher: Texas Instruments; LatestRevisionDate: 2013-01-08; ComponentLink1Description: Datasheet link; ComponentLink1URL: http://www.yageo.com/pdf/Pu-RC0603_51_PbFree_L_2.pdf; Supplier 1: Digi-Key; Supplier Part Number 1: 311-10.0KHRCT-ND; Supplier 2: Mouser; Supplier Part Number 2: 603-RC0603FR-0710KL; Supplier 3: Farnell; Supplier Part Number 3: 9238603
R109 R110 = ERJ-6ENF4991V: RES, 4.99 k, 1%, 0.125 W, 0805; Manufacturer: Panasonic; CompType: Resistor; Value: 4.99k; Res_ohm: 4990; Value_Code: 4k99; Tolerance_%: 1; Power_W: 0.125; Value2: 0.125W; TempCo: 100 ppm/C; EIA_Code: E96; U/M: EA; AEC Category: Q200; SymbolVersion: 2009-05-29; PartNumber: ERJ-6ENF4991V; PackageReference: 0805; RoHS: Y; Value1: 1%; MountType: SMT; Technology: Thick Film; Published: 2008-06-26; Publisher: Texas Instruments; LatestRevisionDate: 2016-02-13; ComponentLink1Description: Datasheet link; ComponentLink1URL: http://www.panasonic.com/industrial/components/pdf/AOA0000CE2.pdf; Supplier 1: Digi-Key; Supplier Part Number 1: P4.99KCCT-ND; Supplier 2: Mouser; Supplier Part Number 2: 667-ERJ-6ENF4991V; Supplier 3: Farnell; Supplier Part Number 3: 2057625; AEC Qualified: ?
R112 = CRCW040210K0FKED: RES, 10.0k ohm, 1%, 0.063W, 0402; Manufacturer: Vishay-Dale; CompType: Resistor; Res_ohm: 10000; Value_Code: 10k0; Tolerance_%: 1; Power_W: 0.063; VDC_V: 50; TempCo: 100 ppm/C; EIA_Code: E96; U/M: EA; SymbolVersion: 2009-05-29; PartNumber: CRCW040210K0FKED; PackageReference: 0402; RoHS: Y; Value1: 1%; Value2: 0.063W; MountType: SMT; Technology: Thick Film; Published: 2008-06-26; Publisher: Texas Instruments; LatestRevisionDate: 2013-11-01; ComponentLink1Description: Datasheet link; ComponentLink1URL: http://www.vishay.com/docs/20035/dcrcwe3.pdf; Supplier 1: Digi-Key; Supplier Part Number 1: 541-10.0KLCT-ND; Supplier 2: Mouser; Supplier Part Number 2: 71-CRCW0402-10K-E3; Supplier 3: Farnell; Supplier Part Number 3: 1469669
R113 = CRCW040212K7FKED: RES, 12.7k ohm, 1%, 0.063W, 0402; Manufacturer: Vishay-Dale; CompType: Resistor; Res_ohm: 12700; Value_Code: 12k7; Tolerance_%: 1; Power_W: 0.063; VDC_V: 50; TempCo: 100 ppm/C; EIA_Code: E96; U/M: EA; SymbolVersion: 2009-05-29; PartNumber: CRCW040212K7FKED; PackageReference: 0402; RoHS: Y; Value1: 1%; Value2: 0.063W; MountType: SMT; Technology: Thick Film; Published: 2008-06-26; Publisher: Texas Instruments; LatestRevisionDate: 2013-11-01; ComponentLink1Description: Datasheet link; ComponentLink1URL: http://www.vishay.com/docs/20035/dcrcwe3.pdf; Supplier 1: Digi-Key; Supplier Part Number 1: 541-12.7KLCT-ND; Supplier 2: Mouser; Supplier Part Number 2: 71-CRCW0402-12.7K-E3; Supplier 3: Farnell; Supplier Part Number 3: 1150808
R114 = CRCW0603200RFKEA: RES, 200 ohm, 1%, 0.1W, 0603; Manufacturer: Vishay-Dale; CompType: Resistor; Value_Code: 200R; Tolerance_%: 1; Power_W: 0.1; VDC_V: 75; TempCo: 100 ppm/C; EIA_Code: E96; U/M: EA; SymbolVersion: 2009-05-29; PartNumber: CRCW0603200RFKEA; PackageReference: 0603; RoHS: Y; Res_ohm: 200; Value1: 1%; Value2: 0.1W; MountType: SMT; Technology: Thick Film; Published: 2008-06-26; Publisher: Texas Instruments; LatestRevisionDate: 2013-01-08; ComponentLink1Description: Datasheet link; ComponentLink1URL: http://www.vishay.com/docs/20035/dcrcwe3.pdf; Supplier 1: Digi-Key; Supplier Part Number 1: 541-200HCT-ND; Supplier 2: Mouser; Supplier Part Number 2: 71-CRCW0603-200-E3; Supplier 3: Farnell; Supplier Part Number 3: 1469777
R115 = CRCW04025K49FKED: RES, 5.49k ohm, 1%, 0.063W, 0402; Manufacturer: Vishay-Dale; CompType: Resistor; Res_ohm: 5490; Value_Code: 5k49; Tolerance_%: 1; Power_W: 0.063; VDC_V: 50; TempCo: 100 ppm/C; EIA_Code: E96; U/M: EA; SymbolVersion: 2009-05-29; PartNumber: CRCW04025K49FKED; PackageReference: 0402; RoHS: Y; Value1: 1%; Value2: 0.063W; MountType: SMT; Technology: Thick Film; Published: 2008-06-26; Publisher: Texas Instruments; LatestRevisionDate: 2013-01-08; ComponentLink1Description: Datasheet link; ComponentLink1URL: http://www.vishay.com/docs/20035/dcrcwe3.pdf; Supplier 1: Digi-Key; Supplier Part Number 1: 541-5.49KLCT-ND; Supplier 2: Mouser; Supplier Part Number 2: 71-CRCW0402-5.49K-E3; Supplier 3: Farnell; Supplier Part Number 3: 1151331
R116 = CRCW0402330KJNED: RES, 330k ohm, 5%, 0.063W, 0402; Manufacturer: Vishay-Dale; CompType: Resistor; Res_ohm: 330000; Tolerance_%: 5; Power_W: 0.063; VDC_V: 50; TempCo: 200 ppm/C; EIA_Code: E24; U/M: EA; SymbolVersion: 2009-05-29; PartNumber: CRCW0402330KJNED; PackageReference: 0402; RoHS: Y; Value_Code: 330k; Value1: 5%; Value2: 0.063W; MountType: SMT; Technology: Thick Film; Published: 2008-06-26; Publisher: Texas Instruments; LatestRevisionDate: 2013-01-08; ComponentLink1Description: Datasheet link; ComponentLink1URL: http://www.vishay.com/docs/20035/dcrcwe3.pdf; Supplier 1: Digi-Key; Supplier Part Number 1: 541-330KJCT-ND
R117 R118 = CRCW04021K00JNED: RES, 1.0k ohm, 5%, 0.063W, 0402; Manufacturer: Vishay-Dale; CompType: Resistor; Res_ohm: 1000; Value_Code: 1k00; Tolerance_%: 5; Power_W: 0.063; VDC_V: 50; TempCo: 200 ppm/C; EIA_Code: E24; U/M: EA; SymbolVersion: 2009-05-29; PartNumber: CRCW04021K00JNED; PackageReference: 0402; RoHS: Y; Value1: 5%; Value2: 0.063W; MountType: SMT; Technology: Thick Film; Published: 2008-06-26; Publisher: Texas Instruments; LatestRevisionDate: 2013-01-08; ComponentLink1Description: Datasheet link; ComponentLink1URL: http://www.vishay.com/docs/20035/dcrcwe3.pdf; Supplier 1: Digi-Key; Supplier Part Number 1: 541-1.0KJCT-ND; Supplier 2: Farnell; Supplier Part Number 2: 1514656; Supplier 3: Newark; Supplier Part Number 3: 59M6691
R119 R120 = CRCW080510R0FKEA: RES, 10.0, 1%, 0.125 W, 0805; Manufacturer: Vishay-Dale; CompType: Resistor; Value: 10.0; Res_ohm: 10; Value_Code: 10R0; Tolerance_%: 1; Power_W: 0.125; Value2: 0.125W; VDC_V: 150; TempCo: 100 ppm/C; EIA_Code: E96; U/M: EA; SymbolVersion: 2009-05-29; PartNumber: CRCW080510R0FKEA; PackageReference: 0805; RoHS: Y; Value1: 1%; MountType: SMT; Technology: Thick Film; Published: 2008-06-26; Publisher: Texas Instruments; LatestRevisionDate: 2014-12-05; ComponentLink1Description: Datasheet link; ComponentLink1URL: http://www.vishay.com/docs/20035/dcrcwe3.pdf; Supplier 1: Digi-Key; Supplier Part Number 1: 541-10.0CCT-ND; Supplier 2: Mouser; Supplier Part Number 2: 71-CRCW0805-10-E3; Supplier 3: Farnell; Supplier Part Number 3: 1469859
R121 = CRCW12062K00FKEA: RES, 2.00 k, 1%, 0.25 W, 1206; Manufacturer: Vishay-Dale; CompType: Resistor; Value: 2.00k; Res_ohm: 2000; Value_Code: 2k00; Tolerance_%: 1; Power_W: 0.25; Value2: 0.25W; VDC_V: 200; TempCo: 100 ppm/C; EIA_Code: E96; U/M: EA; AEC Category: Q200; SymbolVersion: 2009-05-29; PartNumber: CRCW12062K00FKEA; PackageReference: 1206; RoHS: Y; Value1: 1%; MountType: SMT; Technology: Thick Film; Published: 2008-06-26; Publisher: Texas Instruments; LatestRevisionDate: 2015-10-21; ComponentLink1Description: Datasheet link; ComponentLink1URL: http://www.vishay.com/docs/20035/dcrcwe3.pdf; Supplier 1: Digi-Key; Supplier Part Number 1: 541-2.00KFCT-ND; Supplier 2: Mouser; Supplier Part Number 2: 71-CRCW1206-2.0K-E3; Supplier 3: Farnell; Supplier Part Number 3: 1469985; AEC Qualified: ?
R122 = CRCW1206100RFKEA: RES, 100, 1%, 0.25 W, 1206; Manufacturer: Vishay-Dale; CompType: Resistor; Value: 100; Value_Code: 100R; Tolerance_%: 1; Power_W: 0.25; Value2: 0.25W; VDC_V: 200; TempCo: 100 ppm/C; EIA_Code: E96; U/M: EA; AEC Category: Q200; SymbolVersion: 2009-05-29; PartNumber: CRCW1206100RFKEA; PackageReference: 1206; RoHS: Y; Res_ohm: 100; Value1: 1%; MountType: SMT; Technology: Thick Film; Published: 2008-06-26; Publisher: Texas Instruments; LatestRevisionDate: 2015-10-21; ComponentLink1Description: Datasheet link; ComponentLink1URL: http://www.vishay.com/docs/20035/dcrcwe3.pdf; Supplier 1: Digi-Key; Supplier Part Number 1: 541-100FCT-ND; Supplier 2: Mouser; Supplier Part Number 2: 71-CRCW1206-100-E3; Supplier 3: Farnell; Supplier Part Number 3: 1469977; AEC Qualified: ?
RT100 = B59751B0120A070: Thermistor NTC, 50 ohm, 25%, D12.5xH16.5mm; Manufacturer: TDK; Tolerance_%: 25; TaMin_C: -40; TaMax_C: 125; U/M: EA; CompType: ThermistorNTC; SymbolVersion: 2008-11-25; PartNumber: B59751B0120A070; Series: B597; PackageReference: D12.5xH16.5mm; MountType: TH; RoHS: Y; ComponentLink1Description: Datasheet link; ComponentLink1URL: http://en.tdk.eu/inf/55/db/PTC_12/PTC_OC_Leaded_380V_1000V_B_B750_B774.pdf; Published: 2009-09-22; Publisher: Texas Instruments; LatestRevisionDate: 2015-09-01; Supplier 1: Digi-Key; Supplier Part Number 1: 495-3880-ND; Supplier 2: Mouser; Supplier Part Number 2: 871-B59751B0120A070; Supplier 3: Farnell; Supplier Part Number 3: 2112820
TP100 TP109 = 5000: Test Point, Miniature, Red, TH; Manufacturer: Keystone; CompType: Test Point Loop; U/M: EA; SymbolVersion: 2008-04-04; PartNumber: 5000; PackageReference: Red Miniature Testpoint; RoHS: Y; MountType: TH; ComponentLink1Description: Datasheet Link; ComponentLink1URL: http://www.keyelco.com/userAssets/file/M60-2p60.pdf; Value: Red; Publisher: Texas Instruments; LatestRevisionDate: 2015-08-25; Supplier 1: Digi-Key; Supplier Part Number 1: 36-5000-ND
TP102 TP103 TP108 = 5001: Test Point, Miniature, Black, TH; Manufacturer: Keystone; CompType: Test Point Loop; U/M: EA; SymbolVersion: 2008-04-04; PartNumber: 5001; PackageReference: Black Miniature Testpoint; RoHS: Y; MountType: TH; ComponentLink1Description: Datasheet Link; ComponentLink1URL: http://www.keyelco.com/userAssets/file/M60-2p60.pdf; Value: Black; Publisher: Texas Instruments; LatestRevisionDate: 2015-08-25; Supplier 1: Digi-Key; Supplier Part Number 1: 36-5001-ND
U100 = ACS716KLATR-12CB-NL-T: 120 kHz Bandwidth, High-Voltage Isolation Current Sensor with Integrated Overcurrent Detection; Manufacturer: Allegro Microsystems Inc; SymbolCreator: Altium; SymbolVersion: 2015-02-12; PartNumber: ACS716KLATR-12CB-NL-T; MountType: SMT; ComponentLink1Description: Datasheet Link; ComponentLink1URL: http://www.allegromicro.com/~/media/Files/Datasheets/ACS716-Datasheet.pdf; RoHS: Y; PackageReference: SOIC, 16-Leads, Body 10.3x7.5mm, Pitch 1.27mm; Publisher: Texas Instruments; LatestRevisionDate: 2015-12-08; Supplier 1: Digi-Key; Supplier Part Number 1: 620-1526-1-ND
U101 = UCC27714D: High-Speed,4A, 600V High-side Low-side Gate Driver Device, D0014A; Manufacturer: Texas Instruments; SymbolCreator: a0411947; CompType: IC; U/M: EA; SymbolVersion: 2013-03-13; PartNumber: UCC27714D; PackageReference: D0014A; MountType: SMT; ComponentLink1Description: Datasheet Link; ComponentLink1URL: https://sps06.itg.ti.com/sites/KMS/crossdivteams/altium/docs/ComponentDatasheets/UCC27714_PreliminaryDatasheet_Rev1p20_May2014.pdf; RoHS: Y; Publisher: Texas Instruments; LatestRevisionDate: 2015-10-23; Alternate Manufacturer: Texas Instruments
U102 = ISO7831FDWR: High-Performance, 8000 VPK Reinforced Triple Digital Isolator, DW0016B; Manufacturer: Texas Instruments; SymbolCreator: Altium; SizeArea_mm2: 107.12; SizeAreaWB_mm2: 152.52; SizeX_mm: 10.4; SizeY_mm: 10.3; SizeZ_mm: 2.65; CompType: IC; U/M: EA; SymbolVersion: 2015-10-13; PartNumber: ISO7831FDWR; Alternate PartNumber: ISO7831FDW; PackageReference: DW0016B; PackageDescription: SOIC-16; MountType: SMT; ComponentLink1Description: Datasheet Link; ComponentLink1URL: http://www.ti.com/lit/ds/symlink/iso7831.pdf; RoHS: Y; Publisher: Texas Instruments; LatestRevisionDate: 2016-05-19; Alternate Manufacturer: Texas Instruments

## Nets that join several sheets
3V3: PMP20873E1_Bias (6 pins), PMP20873E1_Control (16 pins), PMP20873E1_Power (8 pins)
3V3LLC: PMP20873E1_Bias (C322.2 U305.1), PMP20873E1_Power (C127.2 J104.4 U102.16)
5V: PMP20873E1_Bias (11 pins), PMP20873E1_Control (C216.2 J200.4)
7VLLC: PMP20873E1_Bias (6 pins), PMP20873E1_Power (J104.6)
10VLLC: PMP20873E1_Bias (C306.1 C321.1 D302.1 TP303.1), PMP20873E1_Power (J104.8)
12V: PMP20873E1_Bias (14 pins), PMP20873E1_Control (C217.2 J200.5 R224.2), PMP20873E1_Power (7 pins)
AGND: PMP20873E1_Bias (5 pins), PMP20873E1_Control (44 pins), PMP20873E1_Power (11 pins)
LLC_AGND: PMP20873E1_Bias (10 pins), PMP20873E1_Power (5 pins)
PGND_pfc: PMP20873E1_Bias (27 pins), PMP20873E1_Control (9 pins), PMP20873E1_Power (41 pins)
AC_CUR_SENSE: PMP20873E1_Control (R225.1), PMP20873E1_Power (U100.12)
AC_CUR_VREF: PMP20873E1_Control (R212.2 U202.3), PMP20873E1_Power (C121.1 U100.10)
ACL_SENSE: PMP20873E1_Control (C212.1 R217.2 U200.2), PMP20873E1_Power (R102.1)
ACN_SENSE: PMP20873E1_Control (C211.1 R216.2 U200.39), PMP20873E1_Power (R105.1)
HVBUS: PMP20873E1_Bias (5 pins), PMP20873E1_Control (J204.1 R205.2), PMP20873E1_Power (19 pins)
PRI_FAULT: PMP20873E1_Control (U200.20), PMP20873E1_Power (J105.10 U102.4)
Q1_GATE: PMP20873E1_Control (TP200.1 U200.11), PMP20873E1_Power (R117.2)
Q2_GATE: PMP20873E1_Control (TP201.1 U200.12), PMP20873E1_Power (R118.2)
RELAY_CTRL: PMP20873E1_Control (U200.24), PMP20873E1_Power (C188.2 Q100.1 R108.1)
SCI_RX0: PMP20873E1_Control (U200.23), PMP20873E1_Power (U102.5)
SCI_TX0: PMP20873E1_Control (U200.22), PMP20873E1_Power (U102.3)
SWNODE: PMP20873E1_Control (J205.1), PMP20873E1_Power (J101.1 L102.3)

## Assembly variants
001: not fitted FID1 FID2 FID3 J101 J105 TP210